# EAGLE schematic PIC32 (EAGLE 8.1.0)
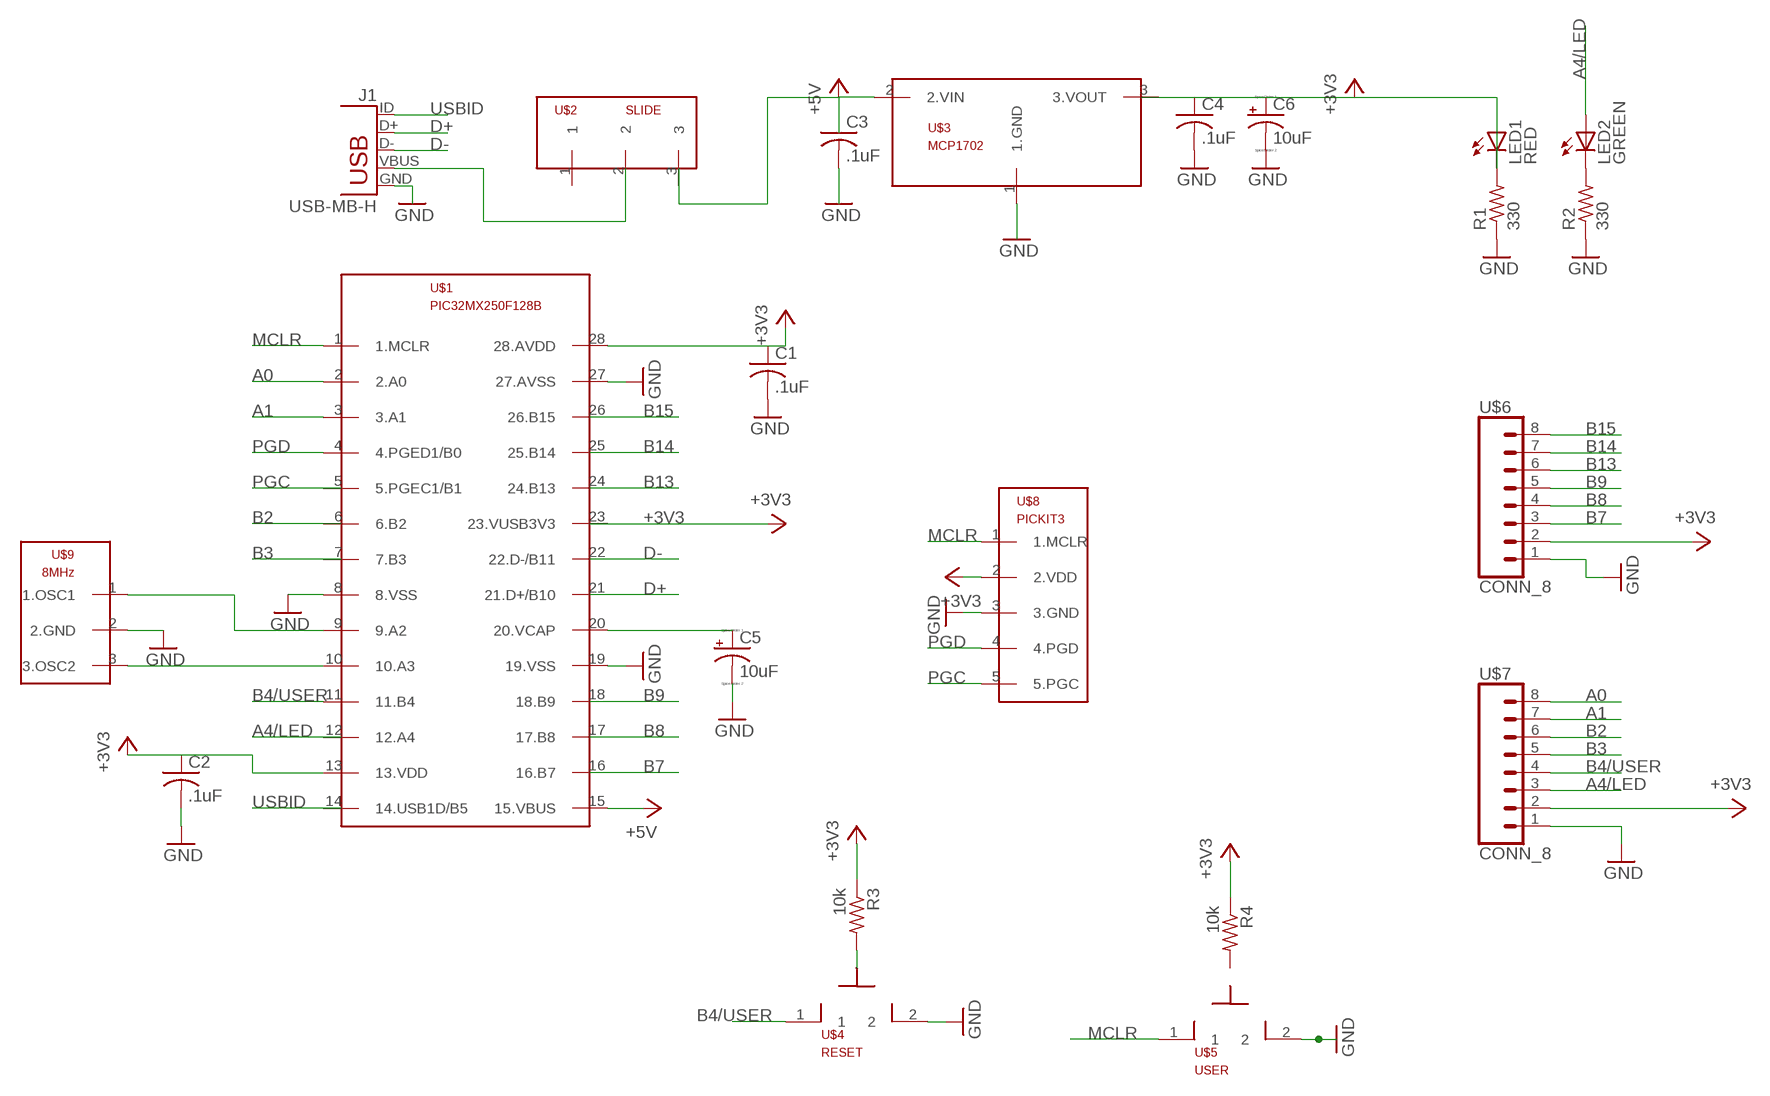
[diagram p0: schematic, sheet 1]

## Parts
C1  .1uF  C-US025-025X050  [C025-025X050]
C2  .1uF  C-US025-025X050  [C025-025X050]
C3  .1uF  C-US025-025X050  [C025-025X050]
C4  .1uF  C-US025-025X050  [C025-025X050]
C5  10uF  CPOL-USB45181B  [B45181B]
C6  10uF  CPOL-USB45181B  [B45181B]
J1  USB-MB-H  [USB-MB-H]
LED1  RED  LED3MM  [LED3MM]
LED2  GREEN  LED3MM  [LED3MM]
R1  330  R-US_0207/10  [0207/10]
R2  330  R-US_0207/10  [0207/10]
R3  10k  R-US_0207/10  [0207/10]
R4  10k  R-US_0207/10  [0207/10]
U$1  PIC32MX250F128B  [DIL28-3]
U$2  SLIDE  [SLIDE]
U$3  MCP1702  [TO92]
U$4  RESET  PB  [PB]
U$5  USER  PB  [PB]
U$6  CONN_8  [1X08]
U$7  CONN_8  [1X08]
U$8  PICKIT3  [1X05]
U$9  8MHz  OSC  [OSC]

## Nets
+3V3: C1.1 C2.1 C4.1 C6.+ LED1.A LED1.K(C) R1.2 R3.1 R4.1 U$1.13(13.VDD) U$1.28(28.AVDD) U$6.2 U$7.2 U$8.2(2.VDD)
+5V: U$1.15(15.VBUS) U$3.2(2.VIN)
A0: U$1.2(2.A0) U$7.8
A1: U$1.3(3.A1) U$7.7
A4/LED: LED2.A U$7.3
B2: U$7.6
B3: U$7.5
B4/USER: U$1.11(11.B4) U$4.1 U$7.4
B7: U$6.3
B8: U$6.4
B9: U$6.5
B13: U$6.6
B14: U$6.7
B15: U$6.8
D+: J1.D+
D-: J1.D-
GND: C1.2 C2.2 C4.2 C5.- C6.- R1.1 R2.1 U$1.8(8.VSS) U$1.19(19.VSS) U$1.27(27.AVSS) U$4.2 U$5.2 U$6.1 U$7.1 U$8.3(3.GND) U$9.2(2.GND)
MCLR: U$1.1(1.MCLR) U$5.1 U$8.1(1.MCLR)
N$1: J1.GND
N$2: R3.2
N$3: U$1.10(10.A3) U$9.3(3.OSC2)
N$4: C3.2
N$5: U$3.1(1.GND)
N$6: U$1.9(9.A2) U$9.1(1.OSC1)
N$7: C5.+ U$1.20(20.VCAP)
N$8: LED2.K(C) R2.2
PGC: U$8.5(5.PGC)
PGD: U$1.4(4.PGED1/B0) U$8.4(4.PGD)
USBID: J1.ID
VBUS: J1.VBUS
Unconnected: C3.1 R4.2 U$1.5(5.PGEC1/B1) U$1.6(6.B2) U$1.7(7.B3) U$1.12(12.A4) U$1.14(14.USB1D/B5) U$1.16(16.B7) U$1.17(17.B8) U$1.18(18.B9) U$1.21(21.D+/B10) U$1.22(22.D-/B11) U$1.23(23.VUSB3V3) U$1.24(24.B13) U$1.25(25.B14) U$1.26(26.B15) U$2.1 U$2.2 U$2.3 U$3.3(3.VOUT)

## Library data of the parts
C1-C4 = ME433:C-US: CAPACITOR, American symbol
C5 C6 = ME433:CPOL-US: POLARIZED CAPACITOR, American symbol
J1 = ME433:USB: USB Connectors USB-B-PTH is fully proven SKU : PRT-00139/CONN-08278 USB-miniB is fully proven SKU : PRT-00587 USB-A-PCB is untested. USB-A-H is throughly reviewed, but untested. Spark Fun Electronics SKU : PRT-00437 USB-B-SMT is throughly reviewed, but untested. Needs silkscreen touching up. USB-A-S has not been used/tested USB-MB-H has not been used/tested USB-MICROB has been used. CONN-09505
LED1 LED2 = led:LED: LED OSRAM: - CHIPLED LG R971, LG N971, LY N971, LG Q971, LY Q971, LO R971, LY R971 LH N974, LH R974 LS Q976, LO Q976, LY Q976 LO Q996 - Hyper CHIPLED LW Q18S LB Q993, LB Q99A, LB R99A - SideLED LS A670, LO A670, LY A670, LG A670, LP A670 LB A673, LV A673, LT A673, LW A673 LH A674 LY A675 LS A676, LA A676, LO A676, LY A676, LW A676 LS A679, LY A679, LG A679 - Hyper Micro SIDELED® LS Y876, LA Y876, LO Y876, LY Y876 LT Y87S - SmartLED LW L88C, LW L88S LB L89C, LB L89S, LG L890 LS L89K, LO L89K, LY L89K LS L896, LA L896, LO L896, LY L896 - TOPLED LS T670, LO T670, LY T670, LG T670, LP T670 LSG T670, LSP T670, LSY T670, LOP T670, LYG T670 LG T671, LOG T671, LSG T671 LB T673, LV T673, LT T673, LW T673 LH T674 LS T676, LA T676, LO T676, LY T676, LB T676, LH T676, LSB T676, LW T676 LB T67C, LV T67C, LT T67C, LS T67K, LO T67K, LY T67K, LW E67C LS E67B, LA E67B, LO E67B, LY E67B, LB E67C, LV E67C, LT E67C LW T67C LS T679, LY T679, LG T679 LS T770, LO T770, LY T770, LG T770, LP T770 LB T773, LV T773, LT T773, LW T773 LH T774 LS E675, LA E675, LY E675, LS T675 LS T776, LA T776, LO T776, LY T776, LB T776 LHGB T686 LT T68C, LB T68C - Hyper Mini TOPLED® LB M676 - Mini TOPLED Santana® LG M470 LS M47K, LO M47K, LY M47K Source: http://www.osram.convergy.de LUXEON: - LUMILED® LXK2-PW12-R00, LXK2-PW12-S00, LXK2-PW14-U00, LXK2-PW14-V00 LXK2-PM12-R00, LXK2-PM12-S00, LXK2-PM14-U00 LXK2-PE12-Q00, LXK2-PE12-R00, LXK2-PE12-S00, LXK2-PE14-T00, LXK2-PE14-U00 LXK2-PB12-K00, LXK2-PB12-L00, LXK2-PB12-M00, LXK2-PB14-N00, LXK2-PB14-P00, LXK2-PB14-Q00 LXK2-PR12-L00, LXK2-PR12-M00, LXK2-PR14-Q00, LXK2-PR14-R00 LXK2-PD12-Q00, LXK2-PD12-R00, LXK2-PD12-S00 LXK2-PH12-R00, LXK2-PH12-S00 LXK2-PL12-P00, LXK2-PL12-Q00, LXK2-PL12-R00 Source: www.luxeon.com KINGBRIGHT: KA-3528ASYC Source: www.kingbright.com
R1-R4 = ME433:R-US_: RESISTOR, American symbol
U$1 = ME433:PIC32MX250F128B
U$2 = ME433:SLIDE
U$3 = ME433:MCP1702
U$4 U$5 = ME433:PB
U$6 U$7 = ME433:CONN_8
U$8 = ME433:PICKIT3
U$9 = ME433:OSC